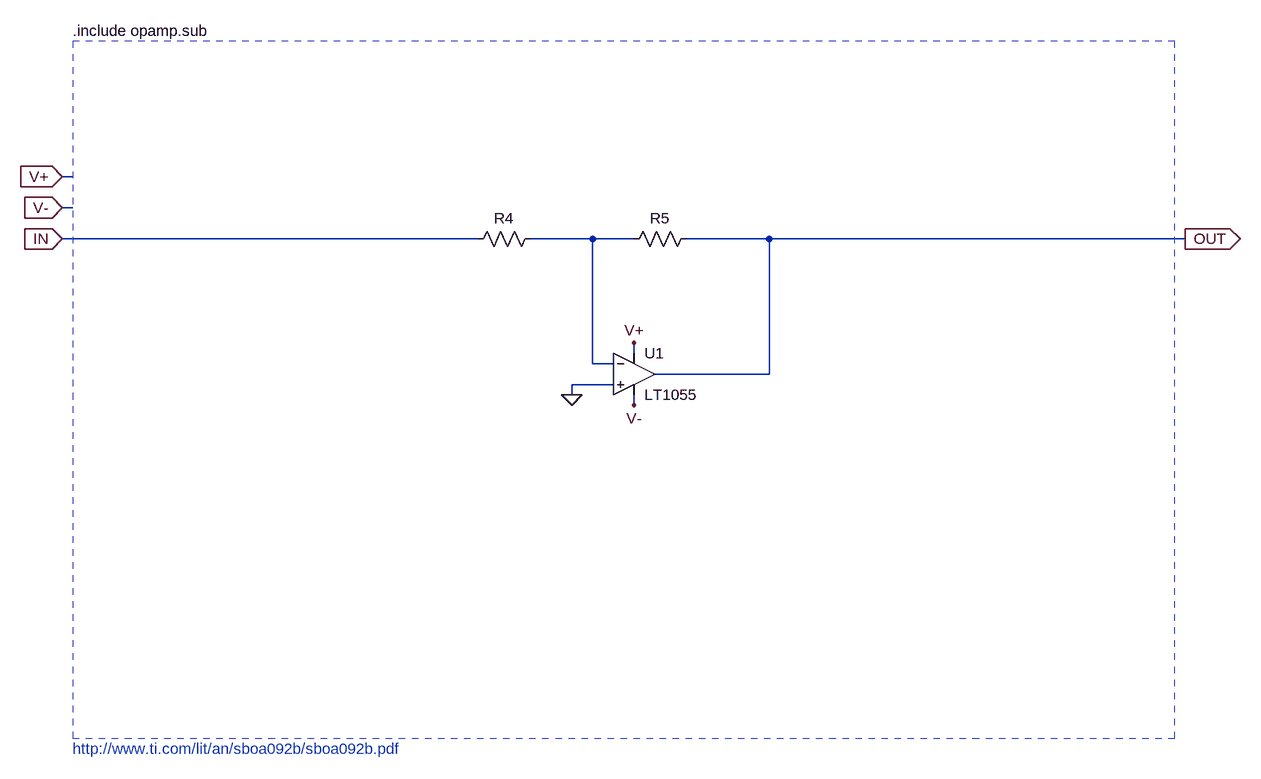
[diagram p0: schematic inverter.asc]
inverter.asc, the LTspice schematic file:
Version 4
SHEET 1 3332 1252
WIRE 1344 240 1328 240
WIRE 1344 288 1328 288
WIRE 1968 336 1328 336
WIRE 2144 336 2048 336
WIRE 2208 336 2144 336
WIRE 2416 336 2288 336
WIRE 3056 336 2416 336
WIRE 2208 512 2208 496
WIRE 2144 528 2144 336
WIRE 2176 528 2144 528
WIRE 2416 544 2416 336
WIRE 2416 544 2240 544
WIRE 2176 560 2112 560
WIRE 2112 576 2112 560
WIRE 2208 592 2208 576
FLAG 2208 496 V+
FLAG 2208 592 V-
FLAG 1328 336 IN
IOPIN 1328 336 In
FLAG 3056 336 OUT
IOPIN 3056 336 Out
FLAG 1328 240 V+
IOPIN 1328 240 In
FLAG 1328 288 V-
IOPIN 1328 288 In
FLAG 2112 576 0
SYMBOL res 1952 352 R270
WINDOW 0 32 56 VTop 2
WINDOW 3 0 56 Invisible 2
SYMATTR InstName R4
SYMATTR Value 10k
SYMBOL res 2304 320 R90
WINDOW 0 0 56 VBottom 2
WINDOW 3 32 56 Invisible 2
SYMATTR InstName R5
SYMATTR Value 10k
SYMBOL Opamps\\LT1055 2208 480 R0
SYMATTR InstName U1
TEXT 1344 16 Left 2 !.include opamp.sub
TEXT 1344 1120 Left 2 ;http://www.ti.com/lit/an/sboa092b/sboa092b.pdf
RECTANGLE Normal 3040 32 1344 1104 2

The netlist it stands for:
* inverter.asc
R4 IN N001 10k
R5 OUT N001 10k
XU1 0 N001 V+ V- OUT LT1055  ; pins In+ In- V+ V- OUT
.include opamp.sub
* http://www.ti.com/lit/an/sboa092b/sboa092b.pdf
.backanno
.end